# Altium schematic sheet Carte_Batterie 2023.SchDoc
size A4; Author: Audran; CompanyName: Goldorak; Address1: Electrolab; Address2: 52 rue Paul Lescop; Address3: 92000 Nanterre; DocumentNumber: 1; SheetNumber: 1; SheetTotal: 5; ProjectName: Cartes_2017
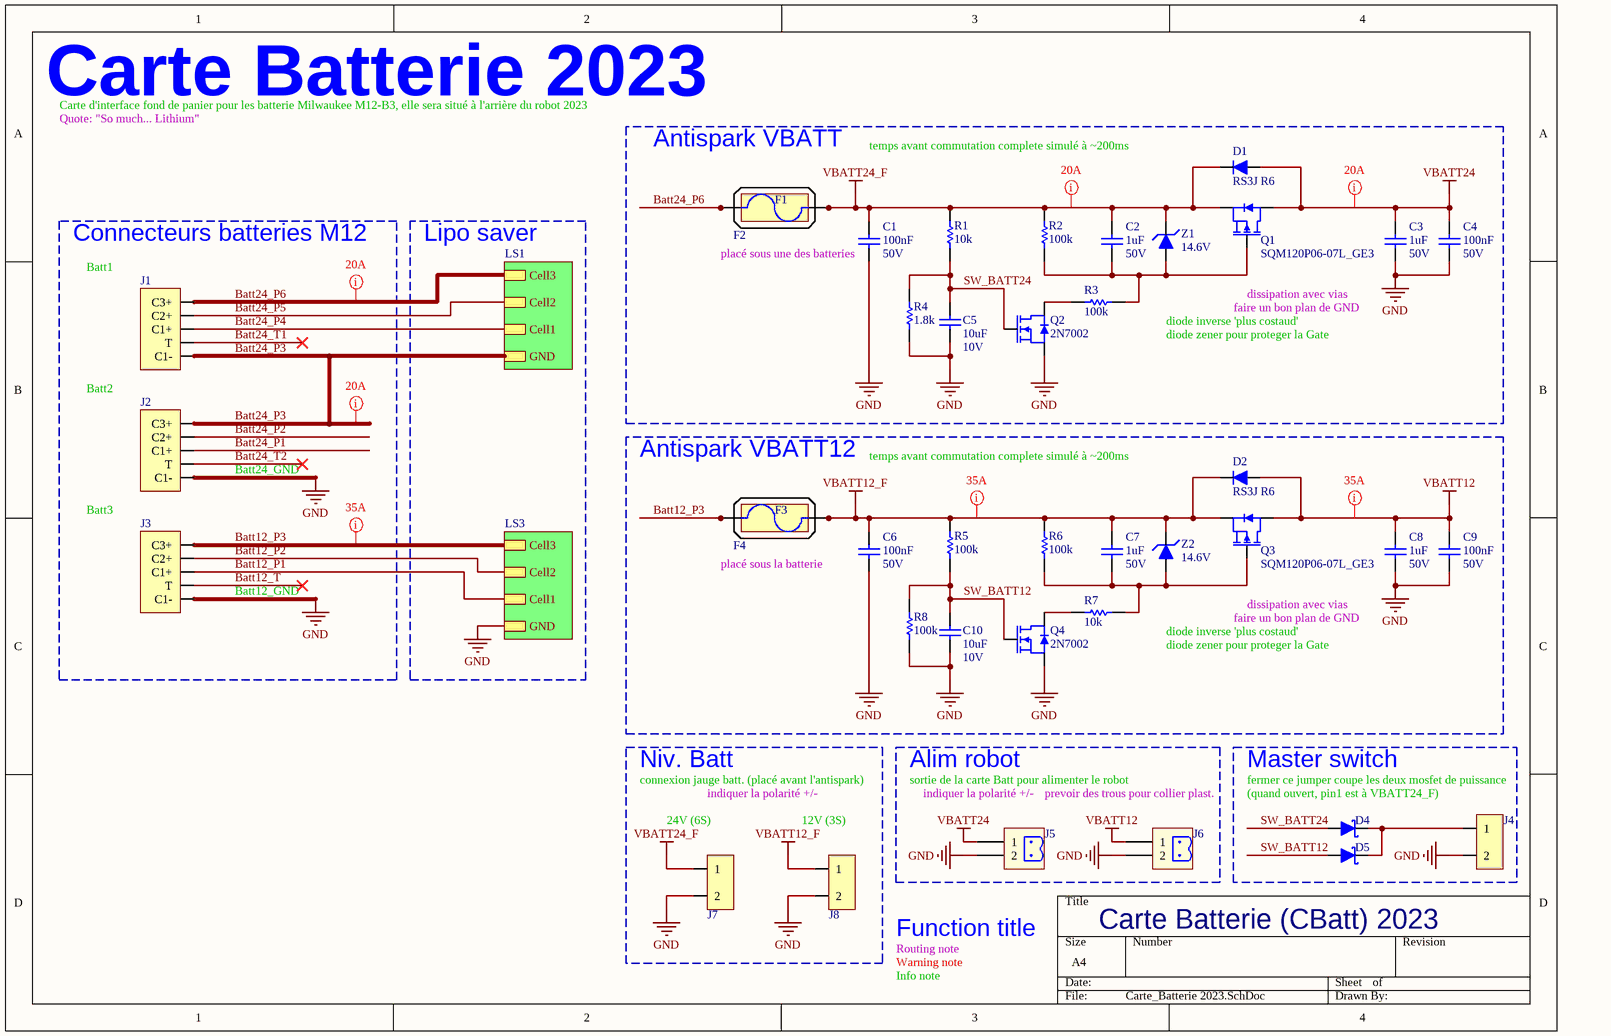
[diagram p0: Carte_Batterie 2023.SchDoc]

## Parts
C1  100nF  RatedVoltage: 50V  [WCAP-CSGP_0603, 1.6x0.8x0.8]
C2  1uF  RatedVoltage: 50V  [WCAP-CSGP_0805, 2x1.25x1.25]
C3  1uF  RatedVoltage: 50V  [WCAP-CSGP_0805, 2x1.25x1.25]
C4  100nF  RatedVoltage: 50V  [WCAP-CSGP_0603, 1.6x0.8x0.8]
C5  10uF  RatedVoltage: 10V  [WCAP-CSGP_0805, 2x1.25x1.25]
C6  100nF  RatedVoltage: 50V  [WCAP-CSGP_0603, 1.6x0.8x0.8]
C7  1uF  RatedVoltage: 50V  [WCAP-CSGP_0805, 2x1.25x1.25]
C8  1uF  RatedVoltage: 50V  [WCAP-CSGP_0805, 2x1.25x1.25]
C9  100nF  RatedVoltage: 50V  [WCAP-CSGP_0603, 1.6x0.8x0.8]
C10  10uF  RatedVoltage: 10V  [WCAP-CSGP_0805, 2x1.25x1.25]
D1  RS3J R6  [SMC, DO-214AB]
D2  RS3J R6  [SMC, DO-214AB]
D4  RBR3MM40ATFTR  [SOD-123FL]  (value not drawn)
D5  RBR3MM40ATFTR  [SOD-123FL]  (value not drawn)
F1  0891030.NXS  (value not drawn)  (mechanical)
F2  3557-2  [3557-2]  (value not drawn)
F3  0891030.NXS  (value not drawn)  (mechanical)
F4  3557-2  [3557-2]  (value not drawn)
J1  custom connector  [CONN_BATT-M12]  (value not drawn)
J2  custom connector  [CONN_BATT-M12]  (value not drawn)
J3  custom connector  [CONN_BATT-M12]  (value not drawn)
J4  22-03-2021  [Conn_22-03-2021]  (value not drawn)
J5  691311500102  [691311500102]  (value not drawn)
J6  691311500102  [691311500102]  (value not drawn)
J7  22-03-2021  [Conn_22-03-2021]  (value not drawn)
J8  22-03-2021  [Conn_22-03-2021]  (value not drawn)
Q1  SQM120P06-07L_GE3  [TO263AB, D2PAK]
Q2  2N7002  [SOT-23]
Q3  SQM120P06-07L_GE3  [TO263AB, D2PAK]
Q4  2N7002  [SOT-23]
R1  value 10k  [RESC1608X06N]  (hidden comment: RC0603FR-0710KL)
R2  value 100k  [RESC1608X06N]  (hidden comment: RC0603FR-07100KL)
R3  value 100k  [RESC1608X06N]  (hidden comment: RC0603FR-07100KL)
R4  value 1.8k  [RESC1608X06N]  (hidden comment: RC0603FR-071K8L)
R5  value 100k  [RESC1608X06N]  (hidden comment: RC0603FR-07100KL)
R6  value 100k  [RESC1608X06N]  (hidden comment: RC0603FR-07100KL)
R7  value 10k  [RESC1608X06N]  (hidden comment: RC0603FR-0710KL)
R8  value 100k  [RESC1608X06N]  (hidden comment: RC0603FR-07100KL)
Z1  value 14.6V  [SOD-323]  (hidden comment: MM3Z15VST1G)
Z2  value 14.6V  [SOD-323]  (hidden comment: MM3Z15VST1G)

## Blocks framed on the sheet
Antispark VBATT: C1-C5 D1 F1 F2 Q1 Q2 R1-R4 Z1
Connecteurs batteries M12: J1-J3
Antispark VBATT12: C6-C10 D2 F3 F4 Q3 Q4 R5-R8 Z2
Niv. Batt: J7 J8
Alim robot: J5 J6
Master switch: D4 D5 J4

## Sub-sheets
LS1 = Lipo_Saver_Buzzer_only.SchDoc: Cell3, Cell2, Cell1, GND  | DeviceSheetTitle: Device Sheet Title
LS3 = Lipo_Saver_Buzzer_only.SchDoc: Cell3, Cell2, Cell1, GND  | DeviceSheetTitle: Device Sheet Title

## Nets
GND: C1.1 C3.1 C4.1 C5.1 C6.1 C8.1 C9.1 C10.1 J2.5(C1-) J3.5(C1-) J4.2 J5.2 J6.2 J7.2 J8.2 Q2.2(S) Q4.2(S) R4.1 R8.1 ; sheet LS3/GND
VBATT12: C8.2 C9.2 D2.1 J6.1 Q3.4(D)
VBATT12_F: C6.2 C7.2 D2.2 F4.2 F4.4 J8.1 Q3.3(S) R5.2 R6.2 Z2.2
VBATT24: C3.2 C4.2 D1.1 J5.1 Q1.4(D)
VBATT24_F: C1.2 C2.2 D1.2 F2.2 F2.4 J7.1 Q1.3(S) R1.2 R2.2 Z1.2
Batt12_P1: J3.3(C1+) ; sheet LS3/Cell1
Batt12_P2: J3.2(C2+) ; sheet LS3/Cell2
Batt12_P3: F4.1 F4.3 J3.1(C3+) ; sheet LS3/Cell3
Batt12_T: J3.4(T)
Batt24_P1: J2.3(C1+)
Batt24_P2: J2.2(C2+)
Batt24_P3: J1.5(C1-) J2.1(C3+) ; sheet LS1/GND
Batt24_P4: J1.3(C1+) ; sheet LS1/Cell1
Batt24_P5: J1.2(C2+) ; sheet LS1/Cell2
Batt24_P6: F2.1 F2.3 J1.1(C3+) ; sheet LS1/Cell3
Batt24_T1: J1.4(T)
Batt24_T2: J2.4(T)
SW_BATT12: C10.2 D5.1 Q4.1(G) R5.1 R8.2
SW_BATT24: C5.2 D4.1 Q2.1(G) R1.1 R4.2
NetC2_1: C2.1 Q1.1(G) R2.1 R3.1 Z1.1
NetC7_1: C7.1 Q3.1(G) R6.1 R7.2 Z2.1
NetD4_2: D4.2 D5.2 J4.1
NetQ2_3: Q2.3(D) R3.2
NetQ4_3: Q4.3(D) R7.1

## Layout directives
net class PWR_35A: Batt12_P3, VBATT12, VBATT12_F
net class PWR_20A: Batt24_P3, Batt24_P6, VBATT24, VBATT24_F

## Notes on the sheet
- Carte Batterie 2023
- Carte d'interface fond de panier pour les batterie Milwaukee M12-B3, elle sera situé à l'arrière du robot 2023
- Quote: "So much... Lithium"
- temps avant commutation complete simulé à ~200ms
- Lipo saver
- Batt1
- +
- (near C1) placé sous une des batteries
- faire un bon plan de GND
- dissipation avec vias
- -
- diode inverse 'plus costaud'
- diode zener pour proteger la Gate
- Batt2
- Batt3
- Batt24_GND
- (near C6) placé sous la batterie
- Batt12_GND
- connexion jauge batt. (placé avant l'antispark)
- sortie de la carte Batt pour alimenter le robot
- fermer ce jumper coupe les deux mosfet de puissance
- (near J7) 24V (6S)
- indiquer la polarité +/-
- (near J8) 12V (3S)
- (near J5) indiquer la polarité +/-
- prevoir des trous pour collier plast.
- (quand ouvert, pin1 est à VBATT24_F)
- Routing note
- Warning note
- Info note
- Function title
- Carte Batterie (CBatt) 2023

## Library data of the parts
C1 C4 C6 C9 = WCAP-CSGP, 885012206095: CAP CER 100nF 50V X7R 0603; Manufacturer: Wurth Elektronik; ComponentLink1Description: Datasheet; ComponentLink1URL: http://katalog.we-online.com/pbs/datasheet/885012206095.pdf; Value: 100nF; Size: 0603; CeramicType: X7R; Manufacturer Part Number: 885012206095; Supplier 2: JLCPCB; Supplier Part Number 2: C14663; Supplier Footprint 2: 0603
C2 C3 C7 C8 = WCAP-CSGP, 885012207103: CAP CER 1uF 50V X7R 0805; Manufacturer: Wurth Elektronik; ComponentLink1Description: Datasheet; ComponentLink1URL: http://katalog.we-online.com/pbs/datasheet/885012207103.pdf; Manufacturer Part Number: 885012207103; Value: 1uF; Size: 0805; CeramicType: X7R; Supplier 2: JLCPCB; Supplier Part Number 2: C28323; Supplier Footprint 2: 0805
C5 C10 = WCAP-CSGP, 885012207026: CAP CER 10uF 10V X7R 0805; Manufacturer: Wurth Elektronik; ComponentLink1Description: Datasheet; ComponentLink1URL: http://katalog.we-online.com/pbs/datasheet/885012207026.pdf; Manufacturer Part Number: 885012207026; Value: 10uF; Size: 0805; CeramicType: X7R; Supplier 1: Farnell; Supplier Part Number 1: 2495189; Supplier Part Number 2: C15850; Supplier 2: JLCPCB; Supplier Footprint 2: 0805
D1 D2 = RS3J_R6: DIODE GEN PURP 600V 3A SMC; Manufacturer: TAIWAN SEMICONDUCTOR; Type: Standard; Manufacturer Part Number: RS3J R6; ContinuousForwardCurrent: 3A; Supplier 1: Farnell; Supplier Part Number 1: 2677388; ComponentLink1Description: Datasheet; ComponentLink1URL: http://www.farnell.com/datasheets/2182655.pdf; Value: 600V
D4 D5 = RBR3MM40ATFTR: DIODE SCHOTTKY 40V 3A SOD123-FL; Manufacturer: ROHM; Supplier 1: Farnell; Manufacturer Part Number: RBR3MM40ATFTR; ComponentLink1URL: http://www.farnell.com/datasheets/2067190.pdf; ComponentLink1Description: Datasheet; Supplier Part Number 1: 2581593; ComponentLink2Description: Manufacturer; ComponentLink2URL: http://www.rohm.com/web/global/products/-/product/RBR3MM40ATF; ContinuousForwardCurrent: 3A; Type: Schottky; Supplier 2: JLCPCB; Supplier Part Number 2: C8598; Value: 40V; Supplier Footprint 2: SOD-123
F1 F3 = 0891030.NXS: FUSE AUTO 30A 58VDC BLADE MINI; Manufacturer: Littelfuse Inc.; Manufacturer Part Number: 0891030.NXS; Supplier 1: Digi-Key; Supplier Part Number 1: F4993-ND; ComponentLink1URL: http://www.littelfuse.com/~/media/automotive/datasheets/fuses/passenger-car-and-commercial-vehicle/blade-fuses/littelfuse_lowprofilemini_datasheet.pdf; ComponentLink1Description: Datasheet; Value: 30A
F2 F4 = 3557-2: FUSE Holder 500V 30A PCB; Manufacturer: Keystone Electronics; Value: na; Supplier 1: Farnell; Supplier Part Number 1: 2292904; Manufacturer Part Number: 3557-2; ComponentLink1URL: http://www.keyelco.com/product-pdf.cfm?p=296; ComponentLink1Description: Datasheet
J1-J3 = CONN_BATT-M12: Batterie connector for Milwaukee M12, use 2x RS 125-2006 and 3x RS 125-2000
J4 J7 J8 = 22-03-2021: CONN HEADER VERT 2POS 2.54MM; Manufacturer: MOLEX; Supplier 1: Farnell; Supplier Part Number 1: 9731075; Manufacturer Part Number: 22-03-2021; ComponentLink1URL: http://www.farnell.com/datasheets/1791308.pdf; ComponentLink1Description: Datasheet; ComponentLink2URL: http://www.farnell.com/cad/495071.pdf  http://www.farnell.com/cad/1533907.pdf  http://www.farnell.com/cad/1533907.pdf; ComponentLink2Description: Drawings
J5 J6 = 691311500102: WR-TBL 2p Series 311 - 5.08 mm Closed Vertical PCB Header; Manufacturer: Wurth Electronics Inc.; Value: 2; Manufacturer Part Number: 691311500102; ComponentLink1Description: Datasheet; ComponentLink1URL: https://katalog.we-online.de/em/datasheet/6913115001xx.pdf; Supplier 1: Farnell; Supplier Part Number 1: 1641978
Q1 Q3 = SQM120P06-07L_GE3: MOSFET P 60V 120A D2PAK; Manufacturer: VISHAY; Manufacturer Part Number: SQM120P06-07L_GE3; ComponentLink1Description: Datasheet; ComponentLink1URL: http://www.vishay.com/docs/67026/sqm120p0.pdf; Supplier 1: Farnell; Supplier Part Number 1: 2617099
Q2 Q4 = 2N7002: MOSFET N 60V 115MA SOT23; Manufacturer: Changjiang Electronics Tech (CJ); Manufacturer Part Number: 2N7002; ComponentLink1Description: Datasheet; ComponentLink1URL: https://datasheet.lcsc.com/szlcsc/1810151612_Changjiang-Electronics-Tech-CJ-2N7002_C8545.pdf; Supplier 2: JLCPCB; Supplier Part Number 2: C8545; Supplier 1: Farnell; Supplier Part Number 1: 1510761; Supplier Footprint 2: SOT-23-3
R1 R7 = RC0603FR-0710KL: RES SMD 10K OHM 1% 1/10W 0603; Manufacturer: Yageo; Power: 100mW; Vmax: 50V; Manufacturer Part Number: RC0603FR-0710KL; Type: Thick Film; ComponentLink1Description: Manufacturer; ComponentLink1URL: http://www.yageo.com/NewPortal/_en/index.jsp; ComponentLink2Description: Datasheet; ComponentLink2URL: http://www.farnell.com/datasheets/2167052.pdf; Supplier 1: Farnell; Supplier Part Number 1: 9238603; Precision: ±1%; Supplier 2: JLCPCB; Supplier Part Number 2: C25804; Supplier Footprint 2: 0603
R2 R3 R5 R6 R8 = RC0603FR-07100KL: RES SMD 100K OHM 1% 1/10W 0603; Manufacturer: Yageo; Power: 100mW; Vmax: 50V; Manufacturer Part Number: RC0603FR-07100KL; Type: Thick Film; ComponentLink1Description: Manufacturer; ComponentLink1URL: http://www.yageo.com/NewPortal/_en/index.jsp; ComponentLink2Description: Datasheet; ComponentLink2URL: http://www.farnell.com/datasheets/2167052.pdf; Supplier 1: Farnell; Supplier Part Number 1: 2309107; Precision: ±1%; Supplier 2: JLCPCB; Supplier Part Number 2: C25803; Supplier Footprint 2: 0603
R4 = RC0603FR-071K8L: RES SMD 1.8K OHM 1% 1/10W 0603; Manufacturer: Yageo; Power: 100mW; Vmax: 50V; Manufacturer Part Number: RC0603FR-071K8L; Type: Thick Film; ComponentLink1Description: Manufacturer; ComponentLink1URL: http://www.yageo.com/NewPortal/_en/index.jsp; ComponentLink2Description: Datasheet; ComponentLink2URL: http://www.farnell.com/datasheets/2167052.pdf; Precision: ±1%; Supplier 1: Farnell; Supplier Part Number 1: 9238514; Supplier 2: JLCPCB; Supplier Part Number 2: C4177; Supplier Footprint 2: 0603
Z1 Z2 = MM3Z15VST1G: DIODE ZENER 14.6V 300mW SOD323; Manufacturer: ON Semiconductor; Manufacturer Part Number: MM3Z15VST1G; ComponentLink1URL: http://www.farnell.com/datasheets/2028649.pdf; ComponentLink1Description: Datasheet; Supplier 1: Farnell; Supplier Part Number 1: 2533369; Type: Zener